# Altium schematic sheet VRef_MEZ.SchDoc
size A3; Address1: Address1; Address2: Address2; Address3: Address3; Address4: Address4; DocumentNumber: АБВГ.123456.001 Э3; SheetNumber: 1; Scale: 1:1; DocumentType: Схема электрическая принципиальная; FirstReferrence: АБВГ.123456.001
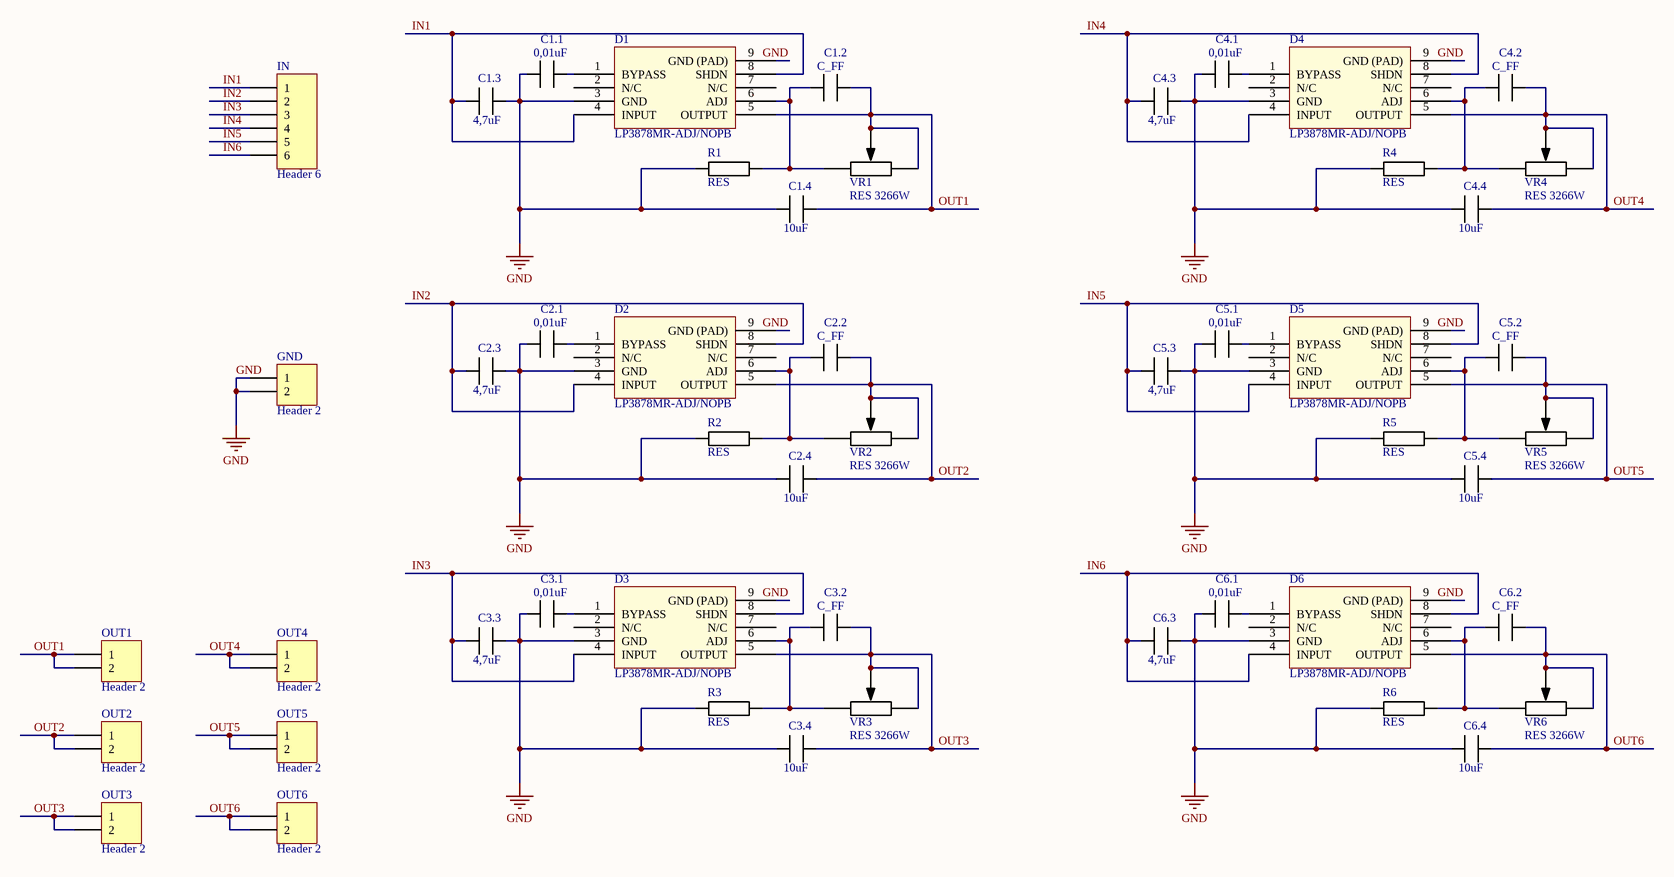
[diagram p0: VRef_MEZ.SchDoc]

## Parts
C1.1  0,01uF  [CAP_1812]
C1.2  C_FF  [CAP_1812]
C1.3  4,7uF  [CAP_1812]
C1.4  10uF  [CAP_1812]
C2.1  0,01uF  [CAP_1812]
C2.2  C_FF  [CAP_1812]
C2.3  4,7uF  [CAP_1812]
C2.4  10uF  [CAP_1812]
C3.1  0,01uF  [CAP_1812]
C3.2  C_FF  [CAP_1812]
C3.3  4,7uF  [CAP_1812]
C3.4  10uF  [CAP_1812]
C4.1  0,01uF  [CAP_1812]
C4.2  C_FF  [CAP_1812]
C4.3  4,7uF  [CAP_1812]
C4.4  10uF  [CAP_1812]
C5.1  0,01uF  [CAP_1812]
C5.2  C_FF  [CAP_1812]
C5.3  4,7uF  [CAP_1812]
C5.4  10uF  [CAP_1812]
C6.1  0,01uF  [CAP_1812]
C6.2  C_FF  [CAP_1812]
C6.3  4,7uF  [CAP_1812]
C6.4  10uF  [CAP_1812]
D1  LP3878MR-ADJ/NOPB  [LP3878MR-ADJ/NOPB]
D2  LP3878MR-ADJ/NOPB  [LP3878MR-ADJ/NOPB]
D3  LP3878MR-ADJ/NOPB  [LP3878MR-ADJ/NOPB]
D4  LP3878MR-ADJ/NOPB  [LP3878MR-ADJ/NOPB]
D5  LP3878MR-ADJ/NOPB  [LP3878MR-ADJ/NOPB]
D6  LP3878MR-ADJ/NOPB  [LP3878MR-ADJ/NOPB]
GND  Header 2  [HDR1X2]
IN  Header 6  [HDR1X6]
OUT1  Header 2  [HDR1X2]
OUT2  Header 2  [HDR1X2]
OUT3  Header 2  [HDR1X2]
OUT4  Header 2  [HDR1X2]
OUT5  Header 2  [HDR1X2]
OUT6  Header 2  [HDR1X2]
R1  RES  [RES_0805]
R2  RES  [RES_0805]
R3  RES  [RES_0805]
R4  RES  [RES_0805]
R5  RES  [RES_0805]
R6  RES  [RES_0805]
VR1  RES 3266W  [RES 3266W]
VR2  RES 3266W  [RES 3266W]
VR3  RES 3266W  [RES 3266W]
VR4  RES 3266W  [RES 3266W]
VR5  RES 3266W  [RES 3266W]
VR6  RES 3266W  [RES 3266W]

## Nets
GND: C1.1.2 C1.3.1 C1.4.2 C2.1.2 C2.3.1 C2.4.2 C3.1.2 C3.3.1 C3.4.2 C4.1.2 C4.3.1 C4.4.2 C5.1.2 C5.3.1 C5.4.2 C6.1.2 C6.3.1 C6.4.2 D1.3(GND) D1.9(GND_(PAD)) D2.3(GND) D2.9(GND_(PAD)) D3.3(GND) D3.9(GND_(PAD)) D4.3(GND) D4.9(GND_(PAD)) D5.3(GND) D5.9(GND_(PAD)) D6.3(GND) D6.9(GND_(PAD)) GND.1 GND.2 R1.1 R2.1 R3.1 R4.1 R5.1 R6.1
IN1: C1.3.2 D1.4(INPUT) D1.8(SHDN) IN.1
IN2: C2.3.2 D2.4(INPUT) D2.8(SHDN) IN.2
IN3: C3.3.2 D3.4(INPUT) D3.8(SHDN) IN.3
IN4: C4.3.2 D4.4(INPUT) D4.8(SHDN) IN.4
IN5: C5.3.2 D5.4(INPUT) D5.8(SHDN) IN.5
IN6: C6.3.2 D6.4(INPUT) D6.8(SHDN) IN.6
OUT1: C1.2.1 C1.4.1 D1.5(OUTPUT) OUT1.1 OUT1.2 VR1.2 VR1.3
OUT2: C2.2.1 C2.4.1 D2.5(OUTPUT) OUT2.1 OUT2.2 VR2.2 VR2.3
OUT3: C3.2.1 C3.4.1 D3.5(OUTPUT) OUT3.1 OUT3.2 VR3.2 VR3.3
OUT4: C4.2.1 C4.4.1 D4.5(OUTPUT) OUT4.1 OUT4.2 VR4.2 VR4.3
OUT5: C5.2.1 C5.4.1 D5.5(OUTPUT) OUT5.1 OUT5.2 VR5.2 VR5.3
OUT6: C6.2.1 C6.4.1 D6.5(OUTPUT) OUT6.1 OUT6.2 VR6.2 VR6.3
NetC1.1_1: C1.1.1 D1.1(BYPASS)
NetC1.2_2: C1.2.2 D1.6(ADJ) R1.2 VR1.1
NetC2.1_1: C2.1.1 D2.1(BYPASS)
NetC2.2_2: C2.2.2 D2.6(ADJ) R2.2 VR2.1
NetC3.1_1: C3.1.1 D3.1(BYPASS)
NetC3.2_2: C3.2.2 D3.6(ADJ) R3.2 VR3.1
NetC4.1_1: C4.1.1 D4.1(BYPASS)
NetC4.2_2: C4.2.2 D4.6(ADJ) R4.2 VR4.1
NetC5.1_1: C5.1.1 D5.1(BYPASS)
NetC5.2_2: C5.2.2 D5.6(ADJ) R5.2 VR5.1
NetC6.1_1: C6.1.1 D6.1(BYPASS)
NetC6.2_2: C6.2.2 D6.6(ADJ) R6.2 VR6.1

Not connected (* = marked no-connect by the designer): D1 2(N/C) 7(N/C); D2 2(N/C) 7(N/C); D3 2(N/C) 7(N/C); D4 2(N/C) 7(N/C); D5 2(N/C) 7(N/C); D6 2(N/C) 7(N/C)

## Notes on the sheet
- Labels drawn without touching a wire or pin: GND
- Title
- Size:
- Date:
- A3
- Number:
- Time:
- Revision:
- Sheet
- of
- File:

## Library data of the parts
C1.1-C1.4 C2.1-C2.4 C3.1-C3.4 C4.1-C4.4 C5.1-C5.4 C6.1-C6.4 = CAP
GND OUT1-OUT6 = Header 2: Header, 2-Pin; LatestRevisionDate: 17-Jul-2002; LatestRevisionNote: Re-released for DXP Platform.; Publisher: Altium Limited
IN = Header 6: Header, 6-Pin; LatestRevisionDate: 17-Jul-2002; LatestRevisionNote: Re-released for DXP Platform.; Publisher: Altium Limited